# EAGLE schematic Humidorium (EAGLE 6.5.0)
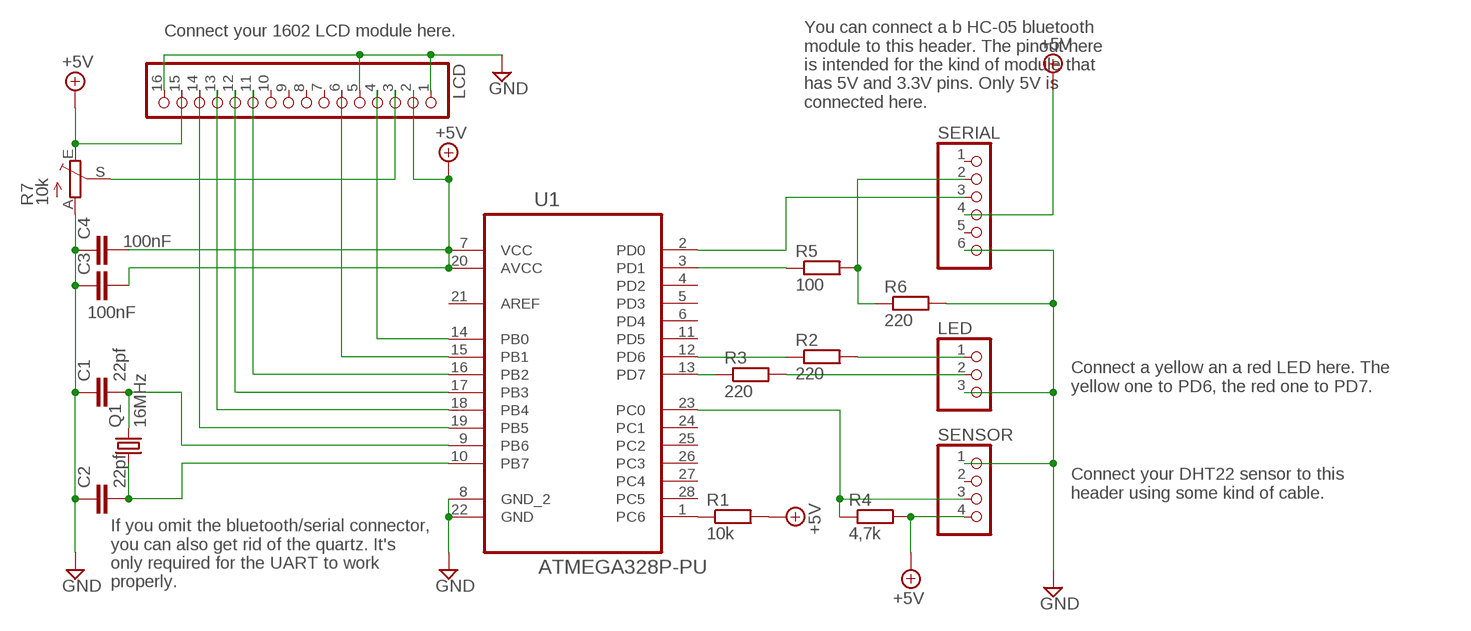
[diagram p0: schematic, sheet 1]

## Parts
C1  22pf  C-EU025-024X044  [C025-024X044]
C2  22pf  C-EU025-024X044  [C025-024X044]
C3  100nF  C-EU025-024X044  [C025-024X044]
C4  100nF  C-EU025-024X044  [C025-024X044]
LCD  PINHD-1X16  [1X16]
LED  PINHD-1X3  [1X03]
Q1  16MHz  CRYSTALHC33U-V  [HC33U-V]
R1  10k  R-EU_0204/2V  [0204V]
R2  220  R-EU_0204/7  [0204/7]
R3  220  R-EU_0204/7  [0204/7]
R4  4,7k  R-EU_0204/7  [0204/7]
R5  100  R-EU_0204/7  [0204/7]
R6  220  R-EU_0204/7  [0204/7]
R7  10k  TRIM_EU-B25P  [B25P]
SENSOR  PINHD-1X4  [1X04]
SERIAL  PINHD-1X6  [1X06]
U1  ATMEGA328P-PU  [DIP254P762X457-28]

## Nets
+5V: C3.2 C4.2 LCD.2 LCD.15 R1.2 R4.2 R7.E SENSOR.4 SERIAL.4 U1.7(VCC) U1.20(AVCC)
GND: C1.1 C2.1 C3.1 C4.1 LCD.1 LCD.5 LCD.16 LED.3 R6.2 R7.A SENSOR.1 SERIAL.6 U1.8(GND_2) U1.22(GND)
N$1: R1.1 U1.1(PC6)
N$2: C2.2 Q1.1 U1.10(PB7)
N$3: C1.2 Q1.2 U1.9(PB6)
N$4: R3.1 U1.13(PD7)
N$6: LED.2 R3.2
N$7: R2.1 U1.12(PD6)
N$8: LED.1 R2.2
N$9: R4.1 SENSOR.3 U1.23(PC0)
N$10: LCD.11 U1.16(PB2)
N$11: LCD.12 U1.17(PB3)
N$12: LCD.13 U1.18(PB4)
N$13: LCD.14 U1.19(PB5)
N$14: LCD.6 U1.15(PB1)
N$15: LCD.4 U1.14(PB0)
N$16: R5.1 U1.3(PD1)
N$17: R5.2 R6.1 SERIAL.2
N$19: LCD.3 R7.S
N$20: SERIAL.3 U1.2(PD0)
Unconnected: LCD.7 LCD.8 LCD.9 LCD.10 SENSOR.2 SERIAL.1 SERIAL.5 U1.4(PD2) U1.5(PD3) U1.6(PD4) U1.11(PD5) U1.21(AREF) U1.24(PC1) U1.25(PC2) U1.26(PC3) U1.27(PC4) U1.28(PC5)

## Notes on the sheet
- Connect your 1602 LCD module here.
- You can connect a b HC-05 bluetooth
  module to this header. The pinout here
  is intended for the kind of module that
  has 5V and 3.3V pins. Only 5V is
  connected here.
- Connect a yellow an a red LED here. The
  yellow one to PD6, the red one to PD7.
- Connect your DHT22 sensor to this
  header using some kind of cable.
- If you omit the bluetooth/serial connector,
  you can also get rid of the quartz. It's
  only required for the UART to work
  properly.

## Library data of the parts
C1-C4 = resistor:C-EU: CAPACITOR, European symbol
LCD = pinhead:PINHD-1X16: PIN HEADER
LED = pinhead:PINHD-1X3: PIN HEADER
Q1 = crystal:CRYSTAL: CRYSTAL; OC_FARNELL: unknown; OC_NEWARK: unknown
R1-R6 = resistor:R-EU_: RESISTOR, European symbol
R7 = pot:TRIM_EU-: POTENTIOMETER
SENSOR = pinhead:PINHD-1X4: PIN HEADER
SERIAL = pinhead:PINHD-1X6: PIN HEADER
U1 = Atmel_By_element14_Batch_1-00:ATMEGA328P-PU: 8-bit Microcontroller with In-System Programmable Flash; MPN: ATMEGA328P-PU; OC_FARNELL: 1715487; OC_NEWARK: 15R0268; PACKAGE: PDIP-28; SUPPLIER: Atmel